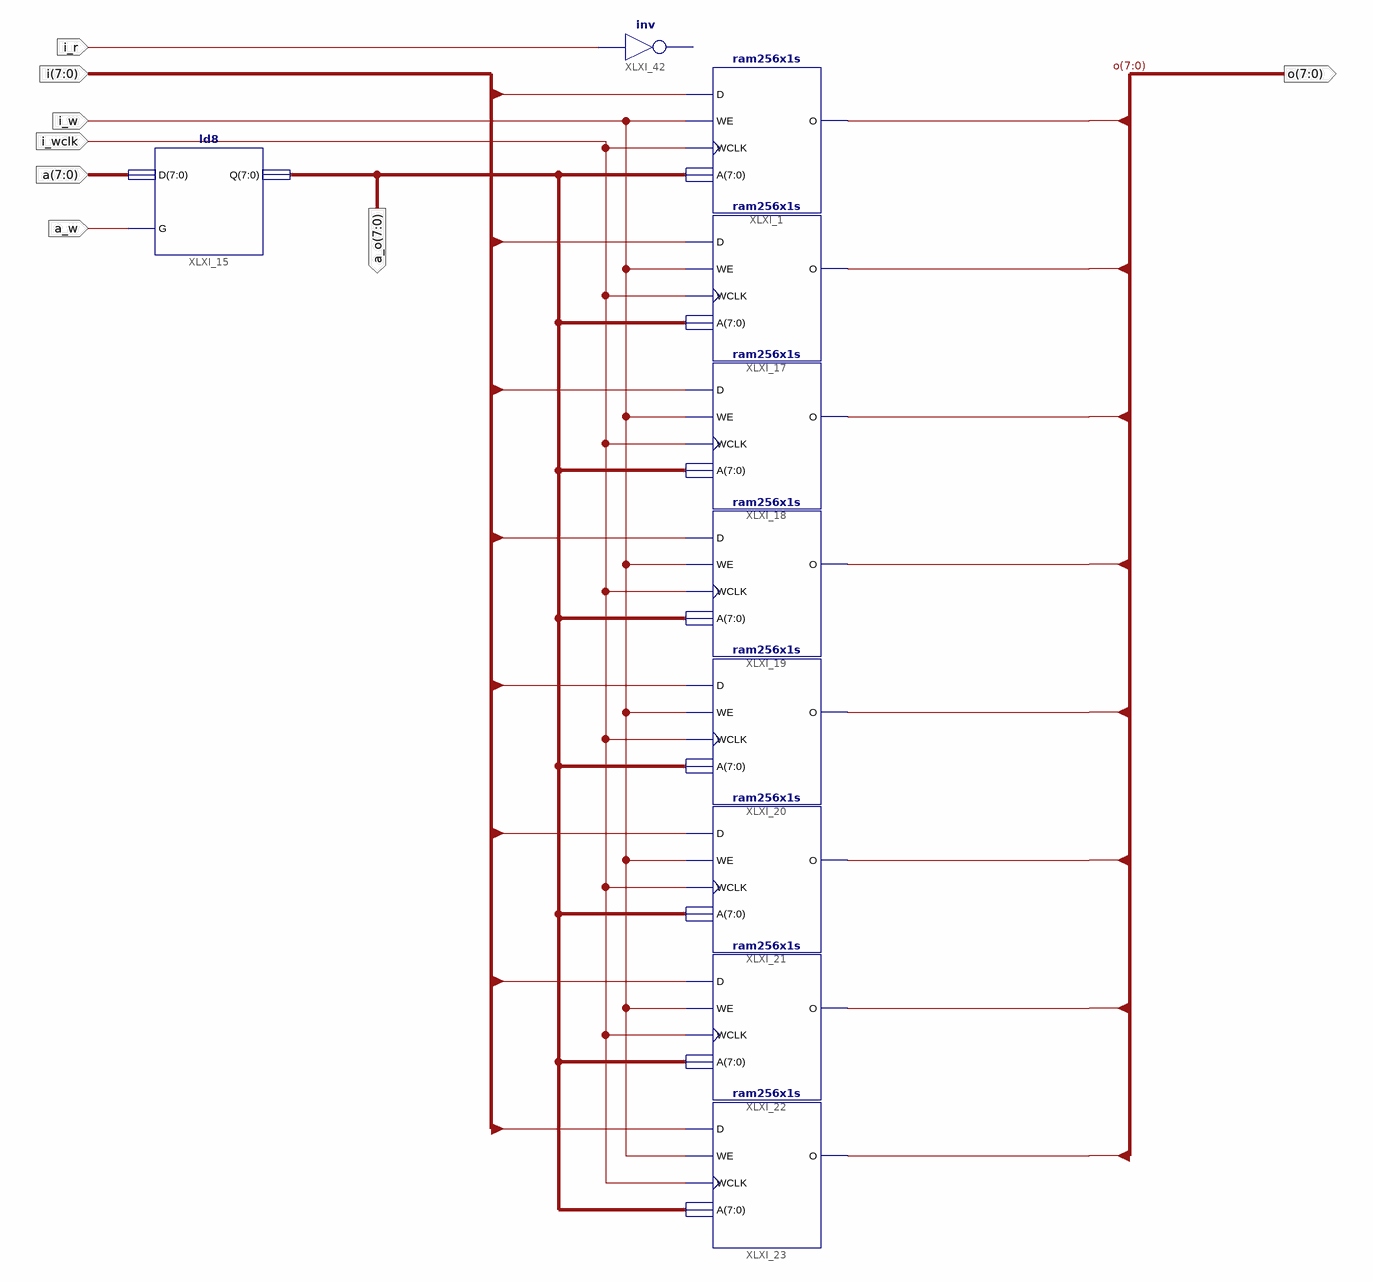
[diagram p0: schematic sheet 1]
// Xilinx ISE schematic ram_256bytes.sch (aspartan6) as structural Verilog: 10 symbols, 8 ports
module ram_256bytes (
  input  a_w,
  input  [7:0] a,
  input  [7:0] i,
  input  i_r,
  input  i_wclk,
  input  i_w,
  output [7:0] a_o,
  output [7:0] o
);

  ld8 XLXI_15 (.D(a), .G(a_w), .Q(a_o));
  ram256x1s #(.INIT("0000000000000000000000000000000000000000000000000000000000000642")) XLXI_1 (
    .WE(i_w), .WCLK(i_wclk), .D(i[0]), .O(o[0]), .A(a_o));
  ram256x1s #(.INIT("0000000000000000000000000000000000000000000000000000000000009100")) XLXI_17 (
    .WE(i_w), .WCLK(i_wclk), .D(i[1]), .O(o[1]), .A(a_o));
  ram256x1s #(.INIT("0000000000000000000000000000000000000000000000000000000000009401")) XLXI_18 (
    .WE(i_w), .WCLK(i_wclk), .D(i[2]), .O(o[2]), .A(a_o));
  ram256x1s #(.INIT("0000000000000000000000000000000000000000000000000000000000000490")) XLXI_19 (
    .WE(i_w), .WCLK(i_wclk), .D(i[3]), .O(o[3]), .A(a_o));
  ram256x1s #(.INIT("0000000000000000000000000000000000000000000000000000000000000380")) XLXI_20 (
    .WE(i_w), .WCLK(i_wclk), .D(i[4]), .O(o[4]), .A(a_o));
  ram256x1s #(.INIT("0000000000000000000000000000000000000000000000000000000000002195")) XLXI_21 (
    .WE(i_w), .WCLK(i_wclk), .D(i[5]), .O(o[5]), .A(a_o));
  ram256x1s #(.INIT("0000000000000000000000000000000000000000000000000000000000006B80")) XLXI_22 (
    .WE(i_w), .WCLK(i_wclk), .D(i[6]), .O(o[6]), .A(a_o));
  ram256x1s #(.INIT("0000000000000000000000000000000000000000000000000000000000000140")) XLXI_23 (
    .WE(i_w), .WCLK(i_wclk), .D(i[7]), .O(o[7]), .A(a_o));
  // inv XLXI_42 has open pins: I=i_r, O=open
endmodule
